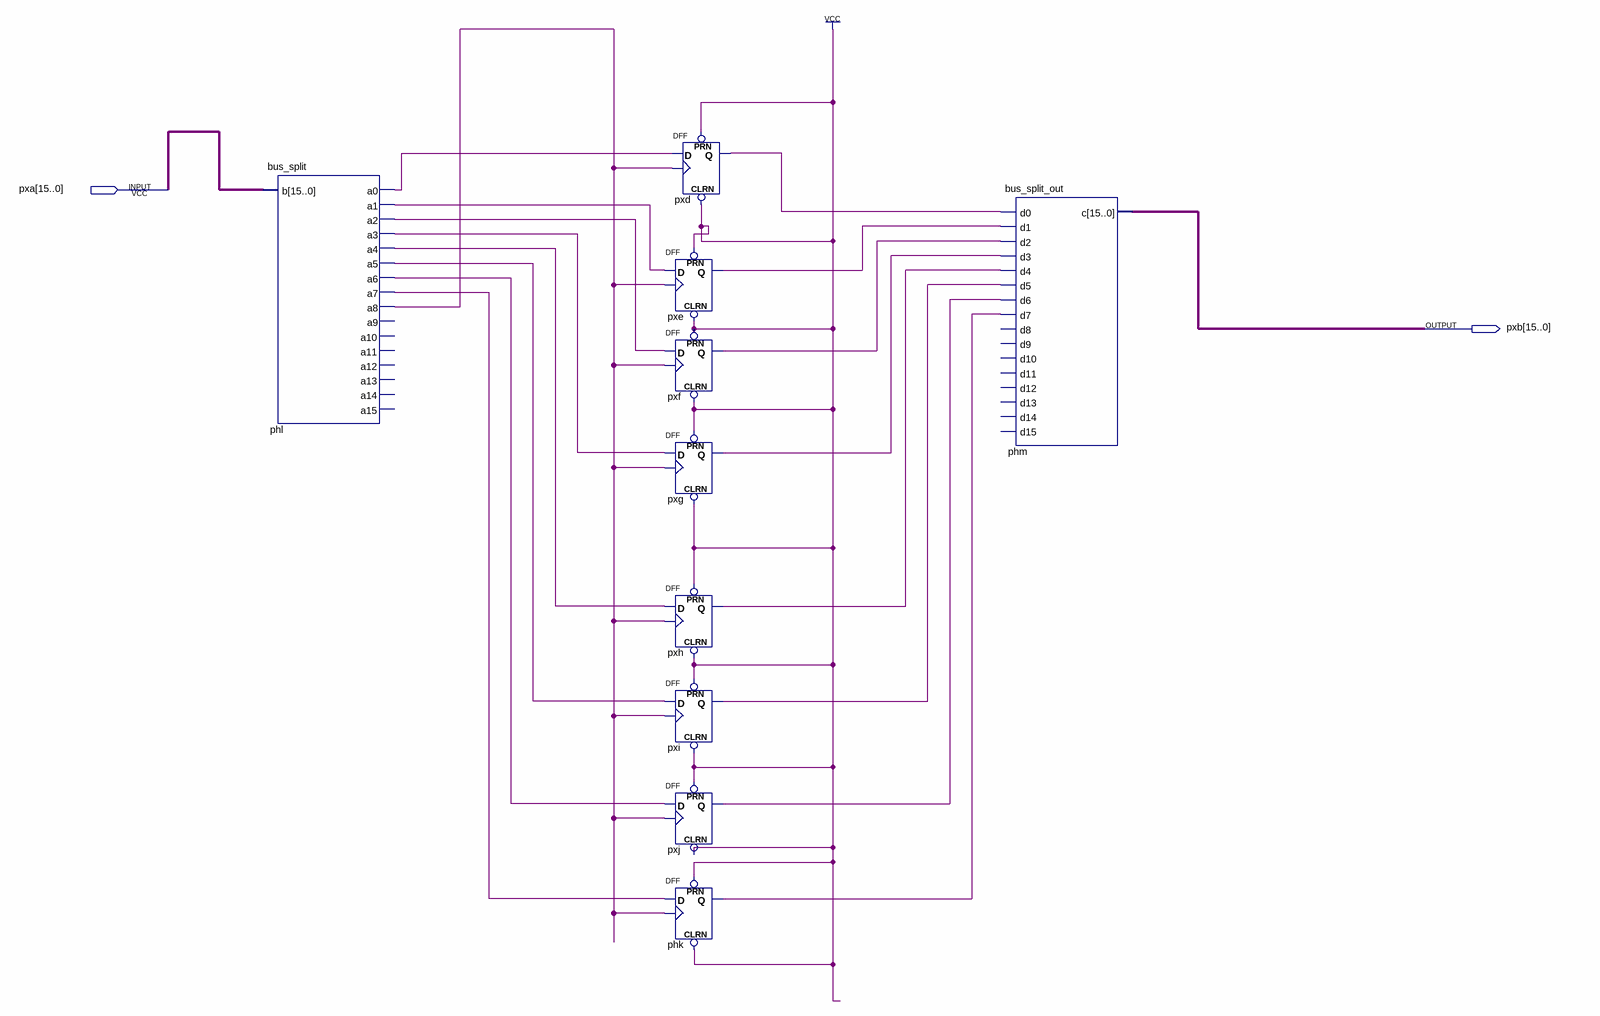
[diagram p0: schematic sheet]
// Quartus schematic eightbitff.bdf as structural Verilog: 10 symbols, 2 pins
module eightbitff (
  input  [15:0] pxa,
  output [15:0] pxb
);

  wire phk_q, phl_a0, phl_a1, phl_a2, phl_a3, phl_a4, phl_a5, phl_a6, phl_a7, phl_a8, pxd_q, pxe_q, pxf_q,
       pxg_q, pxh_q, pxi_q, pxj_q;

  bus_split phl (
    .b(pxa), .a0(phl_a0), .a1(phl_a1), .a2(phl_a2), .a3(phl_a3), .a4(phl_a4), .a5(phl_a5), .a6(phl_a6),
    .a7(phl_a7), .a8(phl_a8));  // open: a9, a10, a11, a12, a13, a14, a15
  DFF pxd (.CLRN(1'b1), .CLK(phl_a8), .D(phl_a0), .PRN(1'b1), .Q(pxd_q));
  DFF pxe (.CLRN(1'b1), .CLK(phl_a8), .D(phl_a1), .PRN(1'b1), .Q(pxe_q));
  DFF pxf (.CLRN(1'b1), .CLK(phl_a8), .D(phl_a2), .PRN(1'b1), .Q(pxf_q));
  DFF pxg (.CLRN(1'b1), .CLK(phl_a8), .D(phl_a3), .PRN(1'b1), .Q(pxg_q));
  DFF pxh (.CLRN(1'b1), .CLK(phl_a8), .D(phl_a4), .PRN(1'b1), .Q(pxh_q));
  DFF pxi (.CLRN(1'b1), .CLK(phl_a8), .D(phl_a5), .PRN(1'b1), .Q(pxi_q));
  DFF pxj (.CLRN(1'b1), .CLK(phl_a8), .D(phl_a6), .PRN(1'b1), .Q(pxj_q));
  DFF phk (.CLRN(1'b1), .CLK(phl_a8), .D(phl_a7), .PRN(1'b1), .Q(phk_q));
  bus_split_out phm (
    .d0(pxd_q), .d1(pxe_q), .d2(pxf_q), .d3(pxg_q), .d4(pxh_q), .d5(pxi_q), .d6(pxj_q), .d7(phk_q), .c(pxb));  // open: d8, d9, d10, d11, d12, d13, d14, d15
endmodule
